# Altium schematic sheet STM32.SchDoc
size A3; SheetNumber: 1; SheetTotal: 5
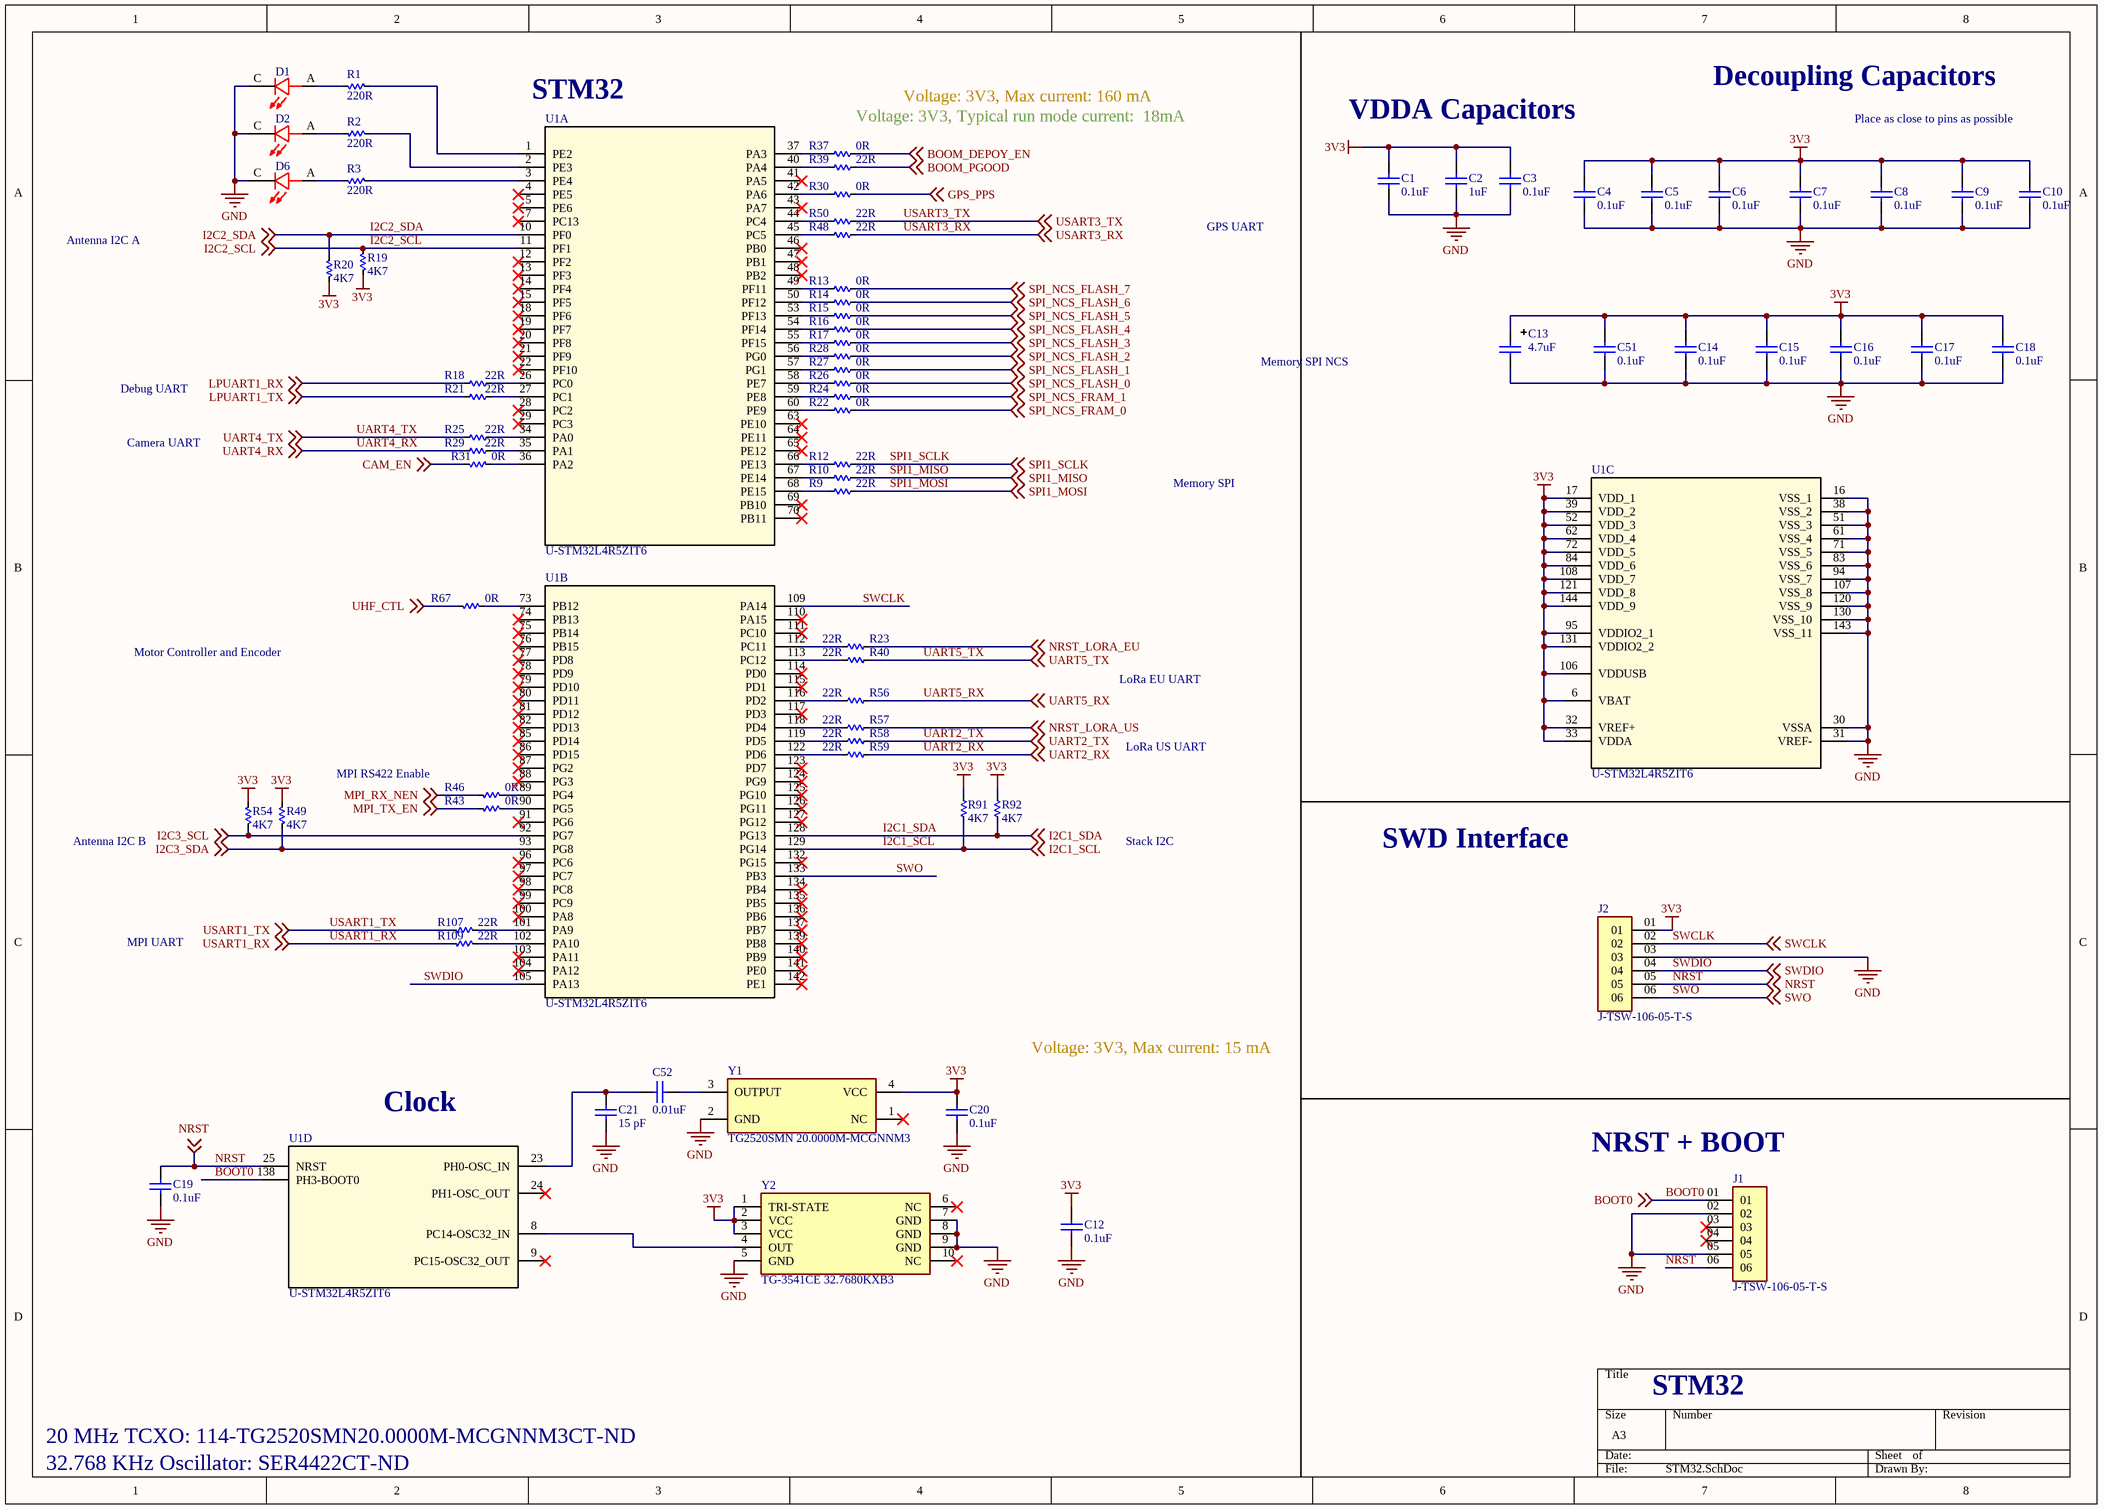
[diagram p0: STM32.SchDoc]

## Parts
C1  0.1uF  [0603]
C2  1uF  [0603]
C3  0.1uF  [0603]
C4  0.1uF  [0603]
C5  0.1uF  [0603]
C6  0.1uF  [0603]
C7  0.1uF  [0603]
C8  0.1uF  [0603]
C9  0.1uF  [0603]
C10  0.1uF  [0603]
C12  0.1uF  [0402]
C13  4.7uF  [CAP TANT 1206 (A) TCJ]
C14  0.1uF  [0603]
C15  0.1uF  [0603]
C16  0.1uF  [0603]
C17  0.1uF  [0603]
C18  0.1uF  [0603]
C19  0.1uF  [0603]
C20  0.1uF  [0402]
C21  15 pF  [0402]
C51  0.1uF  [0603]
C52  0.01uF  [0603]
D1  D-SML-D12U1WT86  [D-SML-D12U1WT86]  (value not drawn)
D2  D-SML-D12U1WT86  [D-SML-D12U1WT86]  (value not drawn)
D6  D-SML-D12U1WT86  [D-SML-D12U1WT86]  (value not drawn)
J1  J-TSW-106-05-T-S  [J-TSW-106-05-T-S]
J2  J-TSW-106-05-T-S  [J-TSW-106-05-T-S]
R1  220R  [0603]
R2  220R  [0603]
R3  220R  [0603]
R9  22R  [0603]
R10  22R  [0603]
R12  22R  [0603]
R13  0R  [0603]
R14  0R  [0603]
R15  0R  [0603]
R16  0R  [0603]
R17  0R  [0603]
R18  22R  [0603]
R19  4K7  [0603]
R20  4K7  [0603]
R21  22R  [0603]
R22  0R  [0603]
R23  22R  [0603]
R24  0R  [0603]
R25  22R  [0603]
R26  0R  [0603]
R27  0R  [0603]
R28  0R  [0603]
R29  22R  [0603]
R30  0R  [0603]
R31  0R  [0603]
R37  0R  [0603]
R39  22R  [0603]
R40  22R  [0603]
R43  0R  [0603]
R46  0R  [0603]
R48  22R  [0603]
R49  4K7  [0603]
R50  22R  [0603]
R54  4K7  [0603]
R56  22R  [0603]
R57  22R  [0603]
R58  22R  [0603]
R59  22R  [0603]
R67  0R  [0603]
R91  4K7  [0603]
R92  4K7  [0603]
R107  22R  [0603]
R109  22R  [0603]
U1  U-STM32L4R5ZIT6  [U-STM32L4R5ZIT6]  (parts A,B,C,D of 4)
Y1  TG2520SMN 20.0000M-MCGNNM3  [Y-TG2520SMN 20.0000M-MCGNNM3]
Y2  TG-3541CE 32.7680KXB3  [Y-TG-3541CE 32.7680KXB3]

## Nets
3V3: C1.2 C2.2 C3.2 C4.2 C5.2 C6.2 C7.2 C8.2 C9.2 C10.2 C12.2 C13.1 C14.2 C15.2 C16.2 C17.2 C18.2 C20.2 C51.2 J2.01 R19.1 R20.1 R49.1 R54.1 R91.2 R92.1 U1.6(VBAT) U1.17(VDD_1) U1.32(VREF+) U1.33(VDDA) U1.39(VDD_2) U1.52(VDD_3) U1.62(VDD_4) U1.72(VDD_5) U1.84(VDD_6) U1.95(VDDIO2_1) U1.106(VDDUSB) U1.108(VDD_7) U1.121(VDD_8) U1.131(VDDIO2_2) U1.144(VDD_9) Y1.4(VCC) Y2.1(TRI-STATE) Y2.2(VCC) Y2.3(VCC)
GND: C1.1 C2.1 C3.1 C4.1 C5.1 C6.1 C7.1 C8.1 C9.1 C10.1 C12.1 C13.2 C14.1 C15.1 C16.1 C17.1 C18.1 C19.1 C20.1 C21.2 C51.1 D1.C D2.C D6.C J1.02 J1.05 J2.03 U1.16(VSS_1) U1.30(VSSA) U1.31(VREF-) U1.38(VSS_2) U1.51(VSS_3) U1.61(VSS_4) U1.71(VSS_5) U1.83(VSS_6) U1.94(VSS_7) U1.107(VSS_8) U1.120(VSS_9) U1.130(VSS_10) U1.143(VSS_11) Y1.2(GND) Y2.5(GND) Y2.7(GND) Y2.8(GND) Y2.9(GND)
BOOM_DEPOY_EN: R37.2 ; off-sheet BOOM_DEPOY_EN
BOOM_PGOOD: R39.1 ; off-sheet BOOM_PGOOD
BOOT0: J1.01 U1.138(PH3-BOOT0) ; off-sheet BOOT0
CAM_EN: R31.1 ; off-sheet CAM_EN
GPS_PPS: R30.2 ; off-sheet GPS_PPS
I2C1_SCL: R91.1 U1.129(PG14) ; off-sheet I2C1_SCL
I2C1_SDA: R92.2 U1.128(PG13) ; off-sheet I2C1_SDA
I2C2_SCL: R19.2 U1.11(PF1) ; off-sheet I2C2_SCL
I2C2_SDA: R20.2 U1.10(PF0) ; off-sheet I2C2_SDA
I2C3_SCL: R54.2 U1.92(PG7) ; off-sheet I2C3_SCL
I2C3_SDA: R49.2 U1.93(PG8) ; off-sheet I2C3_SDA
LPUART1_RX: R18.1 ; off-sheet LPUART1_RX
LPUART1_TX: R21.1 ; off-sheet LPUART1_TX
MPI_RX_NEN: R46.2 ; off-sheet MPI_RX_NEN
MPI_TX_EN: R43.2 ; off-sheet MPI_TX_EN
NRST: C19.2 J1.06 J2.05 U1.25(NRST) ; off-sheet NRST
NRST_LORA_EU: R23.2 ; off-sheet NRST_LORA_EU
NRST_LORA_US: R57.2 ; off-sheet NRST_LORA_US
SPI1_MISO: R10.1 ; off-sheet SPI1_MISO
SPI1_MOSI: R9.1 ; off-sheet SPI1_MOSI
SPI1_SCLK: R12.1 ; off-sheet SPI1_SCLK
SPI_NCS_FLASH_0: R26.2 ; off-sheet SPI_NCS_FLASH_0
SPI_NCS_FLASH_1: R27.2 ; off-sheet SPI_NCS_FLASH_1
SPI_NCS_FLASH_2: R28.2 ; off-sheet SPI_NCS_FLASH_2
SPI_NCS_FLASH_3: R17.2 ; off-sheet SPI_NCS_FLASH_3
SPI_NCS_FLASH_4: R16.2 ; off-sheet SPI_NCS_FLASH_4
SPI_NCS_FLASH_5: R15.2 ; off-sheet SPI_NCS_FLASH_5
SPI_NCS_FLASH_6: R14.2 ; off-sheet SPI_NCS_FLASH_6
SPI_NCS_FLASH_7: R13.2 ; off-sheet SPI_NCS_FLASH_7
SPI_NCS_FRAM_0: R22.2 ; off-sheet SPI_NCS_FRAM_0
SPI_NCS_FRAM_1: R24.2 ; off-sheet SPI_NCS_FRAM_1
SWCLK: J2.02 U1.109(PA14) ; off-sheet SWCLK
SWDIO: J2.04 U1.105(PA13) ; off-sheet SWDIO
SWO: J2.06 U1.133(PB3) ; off-sheet SWO
UART2_RX: R59.2 ; off-sheet UART2_RX
UART2_TX: R58.2 ; off-sheet UART2_TX
UART4_RX: R29.1 ; off-sheet UART4_RX
UART4_TX: R25.1 ; off-sheet UART4_TX
UART5_RX: R56.2 ; off-sheet UART5_RX
UART5_TX: R40.2 ; off-sheet UART5_TX
UHF_CTL: R67.1 ; off-sheet UHF_CTL
USART1_RX: R109.2 ; off-sheet USART1_RX
USART1_TX: R107.2 ; off-sheet USART1_TX
USART3_RX: R48.1 ; off-sheet USART3_RX
USART3_TX: R50.1 ; off-sheet USART3_TX
NetC21_1: C21.1 C52.1 U1.23(PH0-OSC_IN)
NetC52_2: C52.2 Y1.3(OUTPUT)
NetD1_A: D1.A R1.1
NetD2_A: D2.A R2.1
NetD6_A: D6.A R3.1
NetR1_2: R1.2 U1.1(PE2)
NetR2_2: R2.2 U1.2(PE3)
NetR3_2: R3.2 U1.3(PE4)
NetR9_2: R9.2 U1.68(PE15)
NetR10_2: R10.2 U1.67(PE14)
NetR12_2: R12.2 U1.66(PE13)
NetR13_1: R13.1 U1.49(PF11)
NetR14_1: R14.1 U1.50(PF12)
NetR15_1: R15.1 U1.53(PF13)
NetR16_1: R16.1 U1.54(PF14)
NetR17_1: R17.1 U1.55(PF15)
NetR18_2: R18.2 U1.26(PC0)
NetR21_2: R21.2 U1.27(PC1)
NetR22_1: R22.1 U1.60(PE9)
NetR23_1: R23.1 U1.112(PC11)
NetR24_1: R24.1 U1.59(PE8)
NetR25_2: R25.2 U1.34(PA0)
NetR26_1: R26.1 U1.58(PE7)
NetR27_1: R27.1 U1.57(PG1)
NetR28_1: R28.1 U1.56(PG0)
NetR29_2: R29.2 U1.35(PA1)
NetR30_1: R30.1 U1.42(PA6)
NetR31_2: R31.2 U1.36(PA2)
NetR37_1: R37.1 U1.37(PA3)
NetR39_2: R39.2 U1.40(PA4)
NetR40_1: R40.1 U1.113(PC12)
NetR43_1: R43.1 U1.90(PG5)
NetR46_1: R46.1 U1.89(PG4)
NetR48_2: R48.2 U1.45(PC5)
NetR50_2: R50.2 U1.44(PC4)
NetR56_1: R56.1 U1.116(PD2)
NetR57_1: R57.1 U1.118(PD4)
NetR58_1: R58.1 U1.119(PD5)
NetR59_1: R59.1 U1.122(PD6)
NetR67_2: R67.2 U1.73(PB12)
NetR107_1: R107.1 U1.101(PA9)
NetR109_1: R109.1 U1.102(PA10)
NetU1_8: U1.8(PC14-OSC32_IN) Y2.4(OUT)

Not connected (* = marked no-connect by the designer): J1 03* 04*; U1 4(PE5)* 5(PE6)* 7(PC13)* 9(PC15-OSC32_OUT)* 12(PF2)* 13(PF3)* 14(PF4)* 15(PF5)* 18(PF6)* 19(PF7)* 20(PF8)* 21(PF9)* 22(PF10)* 24(PH1-OSC_OUT)* 28(PC2)* 29(PC3)* 41(PA5)* 43(PA7)* 46(PB0)* 47(PB1)* 48(PB2)* 63(PE10)* 64(PE11)* 65(PE12)* 69(PB10)* 70(PB11)* 74(PB13)* 75(PB14)* 76(PB15)* 77(PD8)* 78(PD9)* 79(PD10)* 80(PD11)* 81(PD12)* 82(PD13)* 85(PD14)* 86(PD15)* 87(PG2)* 88(PG3)* 91(PG6)* 96(PC6)* 97(PC7)* 98(PC8)* 99(PC9)* 100(PA8)* 103(PA11)* 104(PA12)* 110(PA15)* 111(PC10)* 114(PD0)* 115(PD1)* 117(PD3)* 123(PD7)* 124(PG9)* 125(PG10)* 126(PG11)* 127(PG12)* 132(PG15)* 134(PB4)* 135(PB5)* 136(PB6)* 137(PB7)* 139(PB8)* 140(PB9)* 141(PE0)* 142(PE1)*; Y1 1(NC)*; Y2 6(NC)* 10(NC)*

## Notes on the sheet
- (near U1) STM32
- Voltage: 3V3, Max current: 160 mA
- Decoupling Capacitors
- Voltage: 3V3, Typical run mode current:  18mA
- VDDA Capacitors
- Place as close to pins as possible
- Antenna I2C A
- GPS UART
- Memory SPI NCS
- Debug UART
- Camera UART
- Memory SPI
- Motor Controller and Encoder
- LoRa EU UART
- MPI RS422 Enable
- LoRa US UART
- Antenna I2C B
- Stack I2C
- SWD Interface
- MPI UART
- Voltage: 3V3, Max current: 15 mA
- (near U1) Clock
- (near J1) NRST + BOOT
- STM32
- 20 MHz TCXO: 114-TG2520SMN20.0000M-MCGNNM3CT-ND
- 32.768 KHz Oscillator: SER4422CT-ND

## Library data of the parts
C1 C3-C10 C14-C19 C51 = CC-104-K-25V-X7R-0603: 0.1 µF ±10% 25V Ceramic Capacitor X7R 0603 (1608 Metric); Manufacturer: Samsung Electro-Mechanics; Manufacturer Part #: CL10B104KA8NNNC; ComponentLink1description: Datasheet; ComponentLink1URL: https://ds.yuden.co.jp/TYCOMPAS/ut/detail?pn=TMK105BJ104KV-F%20%20&u=M; ComponentLink2description: Manufacturer Website; Distributor: Digikey; Distributor Part #: 1276-1006-1-ND; Part Description: 0.1 µF ±10% 25V Ceramic Capacitor X7R 0603 (1608 Metric); ComponentLink2URL: https://www.yuden.co.jp/or/; Value: 0.1uF
C2 = CC-105-K-25V-X7R-0603: CAP CER 1UF 25V X7R 0603; Manufacturer: Yageo; Manufacturer Part #: CC0603KRX7R8BB105; ComponentLink1Description: Datasheet; ComponentLink1URL: https://www.yageo.com/upload/media/product/productsearch/datasheet/mlcc/UPY-GPHC_X7R_6.3V-to-50V_18.pdf; ComponentLink2Description: Manufacture Website; ComponentLink2URL: https://www.yageo.com/en/Home; Distributor: Digikey; Distributor Part #: 311-1802-1-ND; Part Description: CAP CER 1UF 25V X7R 0603; SignalCraft Part #: CC-105-K-25V-X7R-0603; Value: 1uF
C12 C20 = CC-104-K-25V-X7R-0402: CAP CER 0.1UF 25V X7R 0402; Manufacturer: YAGEO; Manufacturer Part #: CC0402KPX7R8BB104; ComponentLink1description: Datasheet; ComponentLink1URL: https://ds.yuden.co.jp/TYCOMPAS/ut/detail?pn=TMK105BJ104KV-F%20%20&u=M; ComponentLink2description: Manufacturer Website; Distributor: Digikey; Distributor Part #: 13-CC0402KPX7R8BB104CT-ND; Part Description: CAP CER 0.1UF 25V X7R 0402; ComponentLink2URL: https://www.yuden.co.jp/or/; Value: 0.1uF
C13 = CT-474-M-20V-OTH-1206: 4.7 µF Molded Tantalum Capacitors 20 V 1206 (3216 Metric) 4Ohm; Manufacturer: AVX Corporation; Manufacturer Part #: TAJA475K020RNJ; ComponentLink1Description: Datasheet; ComponentLink1URL: *; ComponentLink2Description: Manufacturer Website; ComponentLink2URL: *; Distributor: Digikey; Distributor Part #: 478-1668-1-ND; Part Description: 4.7 µF Molded Tantalum Capacitors 20 V 1206 (3216 Metric) 4Ohm; Value: 4.7uF
C21 = CC-159-J-50V-C0G-0402: 15 pF ±1% 50V Ceramic Capacitor C0G, NP0 0402 (1005 Metric); Manufacturer: YAGEO; Manufacturer Part #: CC0402FRNPO9BN150; ComponentLink1Description: Datasheet; ComponentLink1URL: *; ComponentLink2Description: Manufacture Website; ComponentLink2URL: *; Distributor: Digikey; Distributor Part #: 311-1642-1-ND; Part Description: 15 pF ±1% 50V Ceramic Capacitor C0G, NP0 0402 (1005 Metric); Value: 15 pF
C52 = CC-105-K-50V-X7R-0603: CAP CER 10000PF 50V X7R 0603; Manufacturer: Samsung Electro-Mechanics; Manufacturer Part #: CL10B103KB8NNNC; ComponentLink1description: Datasheet; ComponentLink1URL: https://ds.yuden.co.jp/TYCOMPAS/ut/detail?pn=TMK105BJ104KV-F%20%20&u=M; ComponentLink2description: Manufacturer Website; Distributor: Digikey; Distributor Part #: 1276-1009-1-ND; Part Description: CAP CER 10000PF 50V X7R 0603; ComponentLink2URL: https://www.yuden.co.jp/or/; Value: 0.01uF
D1 D2 D6 = D-SML-D12U1WT86: Red 620nm LED Indication - Discrete 2.2V 0603 _1608 Metric; Manufacturer: Rohm Semiconductor; Manufacturer Part #: SML-D12U1WT86; Distributor: Digikey; Distributor Part #: SML-D12U1WT86CT-ND
J1 J2 = J-TSW-106-05-T-S: CONN HEADER VERT 6POS 2.54MM; Distrbutor part #: SAM12323-ND; Manufacturer: Samtec; Distrbutor: None; Manufacturer Part #: TSW-106-05-T-S; Price: None
R1-R3 = RT-220R-F-1/16W-0603: 220 Ohms ±0.5% 0.063W, 1/16W Chip Resistor 0603 (1608 Metric) - Thin Film; Manufacturer: Susumu; Manufacturer Part #: RR0816P-221-D; Distributor: Digikey; Distributor Part #: RR08P220DCT-ND; Part Description: 220 Ohms ±0.5% 0.063W, 1/16W Chip Resistor 0603 (1608 Metric) - Thin Film; Value: 220R
R9 R10 R12 R18 R21 R23 R25 R29 R39 R40 R48 R50 R56-R59 R107 R109 = RT-22R0-F-1/16W-0603: 22 Ohms ±0.5% 0.063W, 1/16W Chip Resistor 0603 (1608 Metric) - Thin Film; Manufacturer: Susumu; Manufacturer Part #: RR0816Q-220-D; ComponentLink1description: Datasheet; ComponentLink1URL: https://www.vishay.com/docs/20035/dcrcwe3.pdf; ComponentLink2description: Manufacturer Website; Distributor: Digikey; Distributor Part #: RR08Q22DCT-ND; Part Description: 22 Ohms ±0.5% 0.063W, 1/16W Chip Resistor 0603 (1608 Metric) - Thin Film; ComponentLink2URL: https://www.vishay.com/; Value: 22R
R13-R17 R22 R24 R26-R28 R30 R31 R37 R43 R46 R67 = RT-0R00-F-1/10W-0603: 0 Ohms Jumper 0.1W, 1/10W Chip Resistor 0603 (1608 Metric) Automotive AEC-Q200 Thick Film; Manufacturer: Stackpole Electronics Inc; Manufacturer Part #: RMCF0603ZT0R00; ComponentLink1description: Datasheet; ComponentLink1URL: https://industrial.panasonic.com/ww/products/resistors/chip-resistors/general-purpose-chip-resistors/models/ERJ2GE0R00X; ComponentLink2description: Manufacturer Website; Distributor: Digikey; Distributor Part #: RMCF0603ZT0R00CT-ND; Part Description: 0 Ohms Jumper 0.1W, 1/10W Chip Resistor 0603 (1608 Metric) Automotive AEC-Q200 Thick Film; ComponentLink2URL: https://industrial.panasonic.com/ww/products/resistors/chip-resistors/general-purpose-chip-resistors/models/ERJ2GE0R00X; Value: 0R
R19 R20 R49 R54 R91 R92 = RT-4K7-F-1/16W-0603: RES SMD 4.7K OHM 1% 1/10W 0603; Manufacturer: Bourns Inc.; Manufacturer Part #: CR0603-FX-4701ELF; ComponentLink1description: Datasheet; ComponentLink1URL: https://www.vishay.com/docs/20035/dcrcwe3.pdf; ComponentLink2description: Manufacturer Website; Distributor: Digikey; Distributor Part #: CR0603-FX-4701ELFCT-ND; Part Description: RES SMD 4.7K OHM 1% 1/10W 0603; ComponentLink2URL: https://www.vishay.com/; Value: 4K7
U1 = U-STM32L4R5ZIT6: IC MCU 32BIT 2MB FLASH 144LQFP; Manufacturer: STMicroelectronics; Distributor: Mouser; Manufacturer Part #: STM32L4R5ZIT6; Mouser Part Number: 511-STM32L4R5ZIT6P
Y1 = Y-TG2520SMN 20.0000M-MCGNNM3: XTAL OSC TCXO 20.0000MHZ CSWV; Manufacturer: EPSON; Manufacturer Part #: TG2520SMN 20.0000M-MCGNNM3; Distributor: Digikey; Distributor Part #: 114-TG2520SMN20.0000M-MCGNNM3CT-ND
Y2 = Y-TG-3541CE 32.7680KXB3: XTAL OSC TCXO 32.7680KHZ CMOS; Manufacturer: EPSON; Manufacturer Part #: TG-3541CE 32.7680KXB3; Distributor: Digikey; Distributor Part #: SER4422CT-ND